# Altium schematic sheet mcu.SchDoc
size 292 x 204 mm; ProjectSection: Set ProjectSection in Document Parameters; PageSetup: Record=PageOptions|CenterHorizontal=True|CenterVertical=True|PrintScale=1.00|XCorrection=1.00|YCorrection=1.00|PrintKind=1|BorderSize=5000000|LeftOffset=0|BottomOffset=0|Orientation=2|PaperLength=1000|PaperWidth=1000|Scale=100|PaperSource=7|PrintQuality=1200|MediaType=1|DitherType=10|PaperKind=A4|PrintScaleMode=1
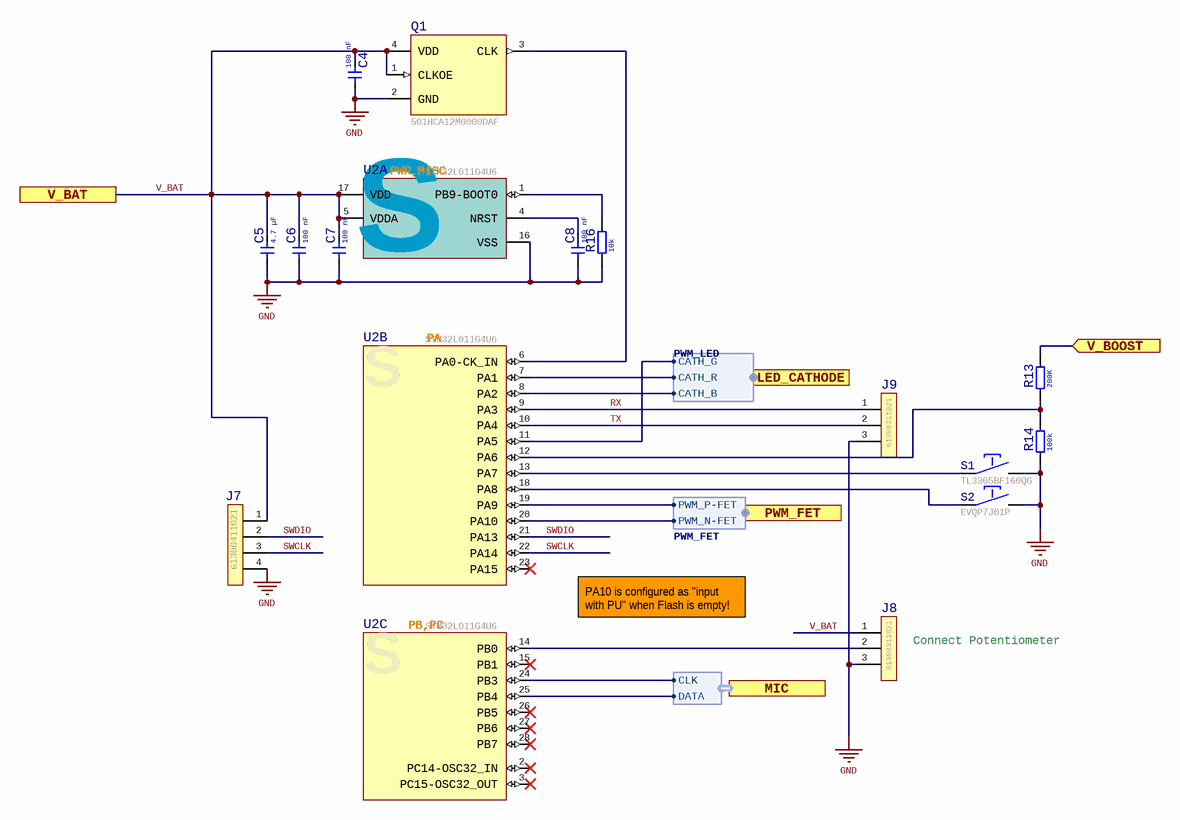
[diagram p0: mcu.SchDoc]

## Parts
C4  value 100 nF  [1608C]  (hidden comment: CAP-NP)
C5  value 4.7 µF  [1608C]  (hidden comment: CAP-NP)
C6  value 100 nF  [1608C]  (hidden comment: CAP-NP)
C7  value 100 nF  [1608C]  (hidden comment: CAP-NP)
C8  value 100 nF  [1608C]  (hidden comment: CAP-NP)
J7  Manufacturer P/N: 61300411021  [CON-04-1-254-H-T-PFL]  (hidden comment: CON-04)
J8  Manufacturer P/N: 61300311021  [CON-03-1-254-H-T-PFL]  (hidden comment: CON-03)
J9  Manufacturer P/N: 61300311021  [CON-03-1-254-H-T-PFL]  (hidden comment: CON-03)
Q1  Manufacturer P/N: 501HCA12M0000DAF  [CRYS-OSC-2.5x2.0]  (hidden comment: CRYS-OSC)
R13  value 200K  [1608R]  (hidden comment: RES)
R14  value 100k  [1608R]  (hidden comment: RES)
R16  value 10k  [1608R]  (hidden comment: RES)
S1  Manufacturer P/N: TL3305BF160QG  [SWI-PU-TL3305BF]  (hidden comment: SWI-PU)
S2  Manufacturer P/N: EVQP7J01P  [SWI-PU-RA-EVQP7(A+J)01P-REVERSEMOUNT]  (hidden comment: SWI-PU)
U2  Manufacturer P/N: STM32L011G4U6  [IC-ST-UFQFN28]  (hidden comment: IC-STM32L011GxUx-QFN28)  (parts A,B,C of 3)

## Ports
LED_CATHODE (harness PWM_LED), MIC (harness MIC), PWM_FET (harness PWM_FET), V_BAT, V_BOOST (in)

## Harnesses
PWM_LED: CATH_R, CATH_B, CATH_G
PWM_FET: PWM_P-FET, PWM_N-FET
MIC: DATA, CLK

## Nets
GND: C4.1 C5.1 C6.1 C7.1 C8.1 J7.4 J8.3 J9.3 Q1.2(GND) R14.1 R16.1 S1.2 S2.2 U2.16(VSS)
RX: J9.1 U2.9(PA3)
SWCLK: J7.3 U2.22(PA14)
SWDIO: J7.2 U2.21(PA13)
TX: J9.2 U2.10(PA4)
V_BAT: C4.2 C5.2 C6.2 C7.2 J7.1 J8.1 Q1.1(CLKOE) Q1.4(VDD) U2.5(VDDA) U2.17(VDD) ; port V_BAT
V_BOOST: R13.2 ; port V_BOOST
NetC8_2: C8.2 U2.4(NRST)
NetJ8_2: J8.2 U2.14(PB0)
NetQ1_3: Q1.3(CLK) U2.6(PA0-CK_IN)
NetR13_1: R13.1 R14.2 U2.12(PA6)
NetR16_2: R16.2 U2.1(PB9-BOOT0)
NetS1_1: S1.1 U2.13(PA7)
NetS2_1: S2.1 U2.18(PA8)
NetU2_7: U2.7(PA1) ; port LED_CATHODE.CATH_R
NetU2_8: U2.8(PA2) ; port LED_CATHODE.CATH_B
NetU2_11: U2.11(PA5) ; port LED_CATHODE.CATH_G
NetU2_19: U2.19(PA9) ; port PWM_FET.PWM_P-FET
NetU2_20: U2.20(PA10) ; port PWM_FET.PWM_N-FET
NetU2_24: U2.24(PB3) ; port MIC.CLK
NetU2_25: U2.25(PB4) ; port MIC.DATA

Not connected (* = marked no-connect by the designer): U2 2(PC14-OSC32_IN)* 3(PC15-OSC32_OUT)* 15(PB1)* 23(PA15)* 26(PB5)* 27(PB6)* 28(PB7)*

## Notes on the sheet
- PA10 is configured as "input with PU" when Flash is empty!
- (near J8) Connect Potentiometer
- Project
- Customer
- File Name
- Part
- Section
- Revision (File)
- Variant
- Revision (Project)
- Date
- Sheet
- Contronix GmbH
- Nizzastr. 6, 01445 Radebeul
- (in symbol IC-STM32L011G4U6-QFN28, part A) PWR,MISC; S
- (in symbol IC-STM32L011G4U6-QFN28, part B) PA; S
- (in symbol IC-STM32L011G4U6-QFN28, part C) PB,PC; S

## Library data of the parts
C4 C6-C8 = CAP-100n-16V-10%-X7R-1608: SMD ceramic capacitor; Manufacturer: Samsung; Manufacturer P/N: CL10B104KO8NNNC; hasAltManufacturer: 0; Contronix P/N: C41RLV; autIdem: 255; NozzleType: 701/901; FeederType: Tape 8mm; FeederPitch: 4mm; NumberOfPins: 2; NumberOfRows: 1; Voltage: 16; Tolerance: 10%; PackageCNTX: 1608; CapacitanceSI: 1E-7; Design Item Id: CAP-100n-16V-10%-X7R-1608; Stock: 700; Price: 0,09; Price (€): 0,09; A I: 255; Supplier 1: Digi-Key; Supplier Part Number 1: 1276-1005-1-ND; Modified: 07.07.2020 16:43:22; Obsolete: 0; Voltage (V): 16; PackageManufacturer: 1608; MountingType: SMT; polarized: 0; Manufacturer Part Number: CL10B104KO8NNNC
C5 = CAP-4u7-10V-10%-X5R-1608: SMD ceramic capacitor, X5R; Manufacturer: Samsung; Manufacturer P/N: CL10A475KP8NNNC; hasAltManufacturer: 0; Contronix P/N: CKAU8N; autIdem: 255; NozzleType: 711/911; FeederType: Tape 8mm; FeederPitch: 4mm; NumberOfPins: 2; NumberOfRows: 1; Voltage: 10; Tolerance: 10%; PackageCNTX: 1608; CapacitanceSI: 4,7E-6; Design Item Id: CAP-4u7-10V-10%-X5R-1608; Stock: 455; Price: 0,13; Price (€): 0,13; A I: 255; ComponentLink1Description: Manufacturer Datasheet; ComponentLink1URL: http://www.samsungsem.com/kr/support/product-search/mlcc/__icsFiles/afieldfile/2019/05/10/19-CL10A475KP8NNNC.pdf; Supplier 1: Digi-Key; Supplier Part Number 1: 1276-1044-1-ND; Modified: 26.06.2020 15:47:54; Obsolete: 0; Voltage (V): 10; PackageManufacturer: 1608; Material: X5R; MountingType: SMT; polarized: 0; Manufacturer Part Number: CL10A475KP8NNNC
J7 = CON-04-1-254-H-T-PFL: 2.54 mm THT Stiftleiste einreihig abgewinkelt; Manufacturer: Würth Elektronik; hasAltManufacturer: 0; Contronix P/N: J47NPE; NumberOfPins: 4; NumberOfRows: 1; Pitch: 2,54; Voltage: 250; Current: 3; Design Item Id: CON-04-1-254-H-T-PFL; Manufacturer Part Number: 61300411021; Price: 0,33; Price (€): 0,33; autIdem: 0; A I: 0; ComponentLink1Description: Manufacturer Datasheet; ComponentLink1URL: http://katalog.we-online.de/em/datasheet/6130xx11021.pdf; Supplier 1: Mouser; Supplier Part Number 1: 710-61300411021; Supplier 2: Digi-Key; Supplier Part Number 2: 732-5337-ND; Created: 26.04.2013 16:53:18; Modified: 08.07.2020 13:51:49; Obsolete: 0; MountingType: THT
J8 J9 = CON-03-1-254-H-T-PFL: 2.54 mm THT Stiftleiste einreihig abgewinkelt WR-PHD; Manufacturer: Würth Elektronik; hasAltManufacturer: 0; Contronix P/N: J7DBHL; autIdem: 255; NumberOfPins: 3; NumberOfRows: 1; Pitch: 2,54; Voltage: 250; Design Item Id: CON-03-1-254-H-T-PFL; Manufacturer Part Number: 61300311021; Stock: 10; Price: 0,22; Price (€): 0,22; A I: 255; Supplier 1: Mouser; Supplier Part Number 1: 710-61300311021; Supplier 2: Digi-Key; Supplier Part Number 2: 732-5336-ND; Created: 26.02.2014 16:48:15; Modified: 19.11.2020 16:50:59; Obsolete: 0; MountingType: THT; Current: 3
Q1 = CRYS-OSC-12MHz-SL-2.5x2-50ppm: Crystal Oscillator; Manufacturer: Silicon Laboratories Inc.; hasAltManufacturer: 0; Contronix P/N: QKVPV6; NumberOfPins: 4; NumberOfRows: 2; Frequency: 12 MHz; Value: 12 MHz; Tolerance: 50 ppm; Rev: =VersionControl_RevNumber; Design Item Id: CRYS-OSC-12MHz-SL-2.5x2-50ppm; Manufacturer Part Number: 501HCA12M0000DAF; ComponentLink1Description: Manufacturer Datasheet; ComponentLink1URL: http://www.silabs.com/Support%20Documents/TechnicalDocs/Si501-2-3.pdf; Supplier 1: Digi-Key; Supplier Part Number 1: 336-2890-ND; Supplier 2: Mouser; Supplier Part Number 2: 634-501HCA12M0000DAF; Created: 09.12.2015 13:31:20; Modified: 31.07.2018 12:04:49; Obsolete: 0
R13 = RES-200K-1%-0.1W-1608: SMD resistor; Manufacturer: Bourns Inc.; Manufacturer P/N: CR0603-FX-2003ELF; hasAltManufacturer: 0; Contronix P/N: RU9VK8; NozzleType: 711/911; FeederType: Tape 8mm; FeederPitch: 4mm; PackageCNTX: 1608; NumberOfPins: 2; NumberOfRows: 1; ResistanceSI: 200; Tolerance: 1%; Power: 0,1; Design Item Id: RES-200K-1%-0.1W-1608; Stock: 990; Price: 0,1; Price (€): 0,1; autIdem: 0; A I: 0; Supplier 1: Mouser; Supplier Part Number 1: 652-CR0603FX-2003ELF; Supplier 2: Digi-Key; Supplier Part Number 2: CR0603-FX-2003ELFCT-ND; Created: 25.09.2019 09:10:32; Modified: 08.10.2019 17:16:22; Obsolete: 0; PackageManufacturer: 1608; Resistance: 200K; MountingType: SMT; Manufacturer Part Number: CR0603-FX-2003ELF
R14 = RES-100k-1%-0.1W-1608: SMD resistor; Manufacturer: Panasonic - ECG; Manufacturer P/N: ERJ-2RKF1003X; hasAltManufacturer: 0; Contronix P/N: RBZVDE; autIdem: 255; NozzleType: 711/911; FeederType: Tape 8mm; FeederPitch: 4mm; PackageCNTX: 1608; NumberOfPins: 2; NumberOfRows: 1; ResistanceSI: 100000; Tolerance: 1%; Power: 0,1; Design Item Id: RES-100k-1%-0.1W-1608; Stock: 3994; Price: 0,01; Price (€): 0,01; A I: 255; ComponentLink1Description: Manufacturer Datasheet; ComponentLink1URL: http://www.mouser.com/ds/2/315/AOA0000C86-911473.pdf; Supplier 1: Digi-Key; Supplier Part Number 1: P100KLCT-ND; Supplier 2: Mouser; Supplier Part Number 2: 667-ERJ-2RKF1003X; Modified: 27.07.2018 09:54:07; Obsolete: 0; PackageManufacturer: 1608; Resistance: 100k; MountingType: SMT; Manufacturer Part Number: ERJ-2RKF1003X
R16 = RES-100k-1%-0.1W-1608: SMD resistor; Manufacturer: Panasonic - ECG; Manufacturer P/N: ERJ-2RKF1003X; hasAltManufacturer: 0; Contronix P/N: RBZVDE; autIdem: 255; NozzleType: 711/911; FeederType: Tape 8mm; FeederPitch: 4mm; PackageCNTX: 1608; NumberOfPins: 2; NumberOfRows: 1; Resistance: 100k; ResistanceSI: 100000; Tolerance: 1%; Power: 0,1; Design Item Id: RES-100k-1%-0.1W-1608; Stock: 3994; Price: 0,01; Price (€): 0,01; A I: 255; ComponentLink1Description: Manufacturer Datasheet; ComponentLink1URL: http://www.mouser.com/ds/2/315/AOA0000C86-911473.pdf; Supplier 1: Digi-Key; Supplier Part Number 1: P100KLCT-ND; Supplier 2: Mouser; Supplier Part Number 2: 667-ERJ-2RKF1003X; Modified: 27.07.2018 09:54:07; Obsolete: 0; PackageManufacturer: 1608; MountingType: SMT; Manufacturer Part Number: ERJ-2RKF1003X
S1 = SWI-PU-TL3305BF160QG: SMD Push Button; Manufacturer: E-Switch; hasAltManufacturer: 0; Contronix P/N: SMYVDF; NozzleType: 701/901; FeederType: Tape 16mm; FeederPitch: 8mm; NumberOfPins: 4; NumberOfRows: 2; Design Item Id: SWI-PU-TL3305BF160QG; Manufacturer Part Number: TL3305BF160QG; Stock: 0; Price: 0,28; Price (€): 0,28; ComponentLink1Description: Manufacturer Drawing; ComponentLink1URL: http://spec_sheets.e-switch.com/specs/P010469.pdf; Supplier 1: Mouser; Supplier Part Number 1: 612-TL3305BF160QG; Supplier 2: Digi-Key; Supplier Part Number 2: EG5351CT-ND; Created: 24.06.2019 10:22:36; Modified: 01.07.2020 16:19:31; Obsolete: 0; Type: Pushbutton SPST; MountingType: SMT
S2 = SWI-PU-RA-EVQP7J01P: SMD Push Button, Right Angle, straight terminals; Manufacturer: Panasonic; hasAltManufacturer: 0; Contronix P/N: SGUKDA; NumberOfPins: 4; NumberOfRows: 2; Design Item Id: SWI-PU-RA-EVQP7J01P; Manufacturer Part Number: EVQP7J01P; Stock: 0; Price: 0,28; Price (€): 0,28; Supplier 1: Mouser; Supplier Part Number 1: 667-EVQP7J01P; Supplier 2: Digi-Key; Supplier Part Number 2: P16767CT-ND; Created: 28.03.2018 19:53:29; Modified: 24.11.2020 18:20:58; Obsolete: 0; Type: Pushbutton SPST; MountingType: SMT
U2 = IC-STM32L011G4U6-QFN28: Access line ultra-low-power 32-bit MCU Arm®-based Cortex®-M0+, 16KB Flash, 2KB SRAM, 512B EEPROM, ADC; Manufacturer: ST Microelectronics; hasAltManufacturer: 0; Contronix P/N: U8HUKC; PackageCNTX: QFN-28; NumberOfPins: 28; NumberOfRows: 4; VoltageMin: 1,65; VoltageMax: 3,6; Core: Cortex-M0+; Flash: 16; RAM: 2; EEPROM: 512; I2C: 1; GPIOs: 24; ADCchannels: 10; ADCbits: 12; Rev: =VersionControl_RevNumber; Design Item Id: IC-STM32L011G4U6-QFN28; Manufacturer Part Number: STM32L011G4U6; Price: 1,9; Price (€): 1,9; ComponentLink1Description: Manufacturer Datasheet; ComponentLink1URL: https://www.st.com/resource/en/datasheet/stm32l011g4.pdf; Supplier 1: Digi-Key; Supplier Part Number 1: 497-18803-1-ND; Supplier 2: Farnell; Supplier Part Number 2: 3365502; Created: 19.11.2020 18:45:38; Modified: 19.11.2020 18:48:52; Obsolete: 0; PackageManufacturer: QFN-28; USART: 1; SPI: 1; RTC: 1; MountingType: SMT